# Altium schematic sheet 30C_battery_Charger.SchDoc
size 508 x 355 mm
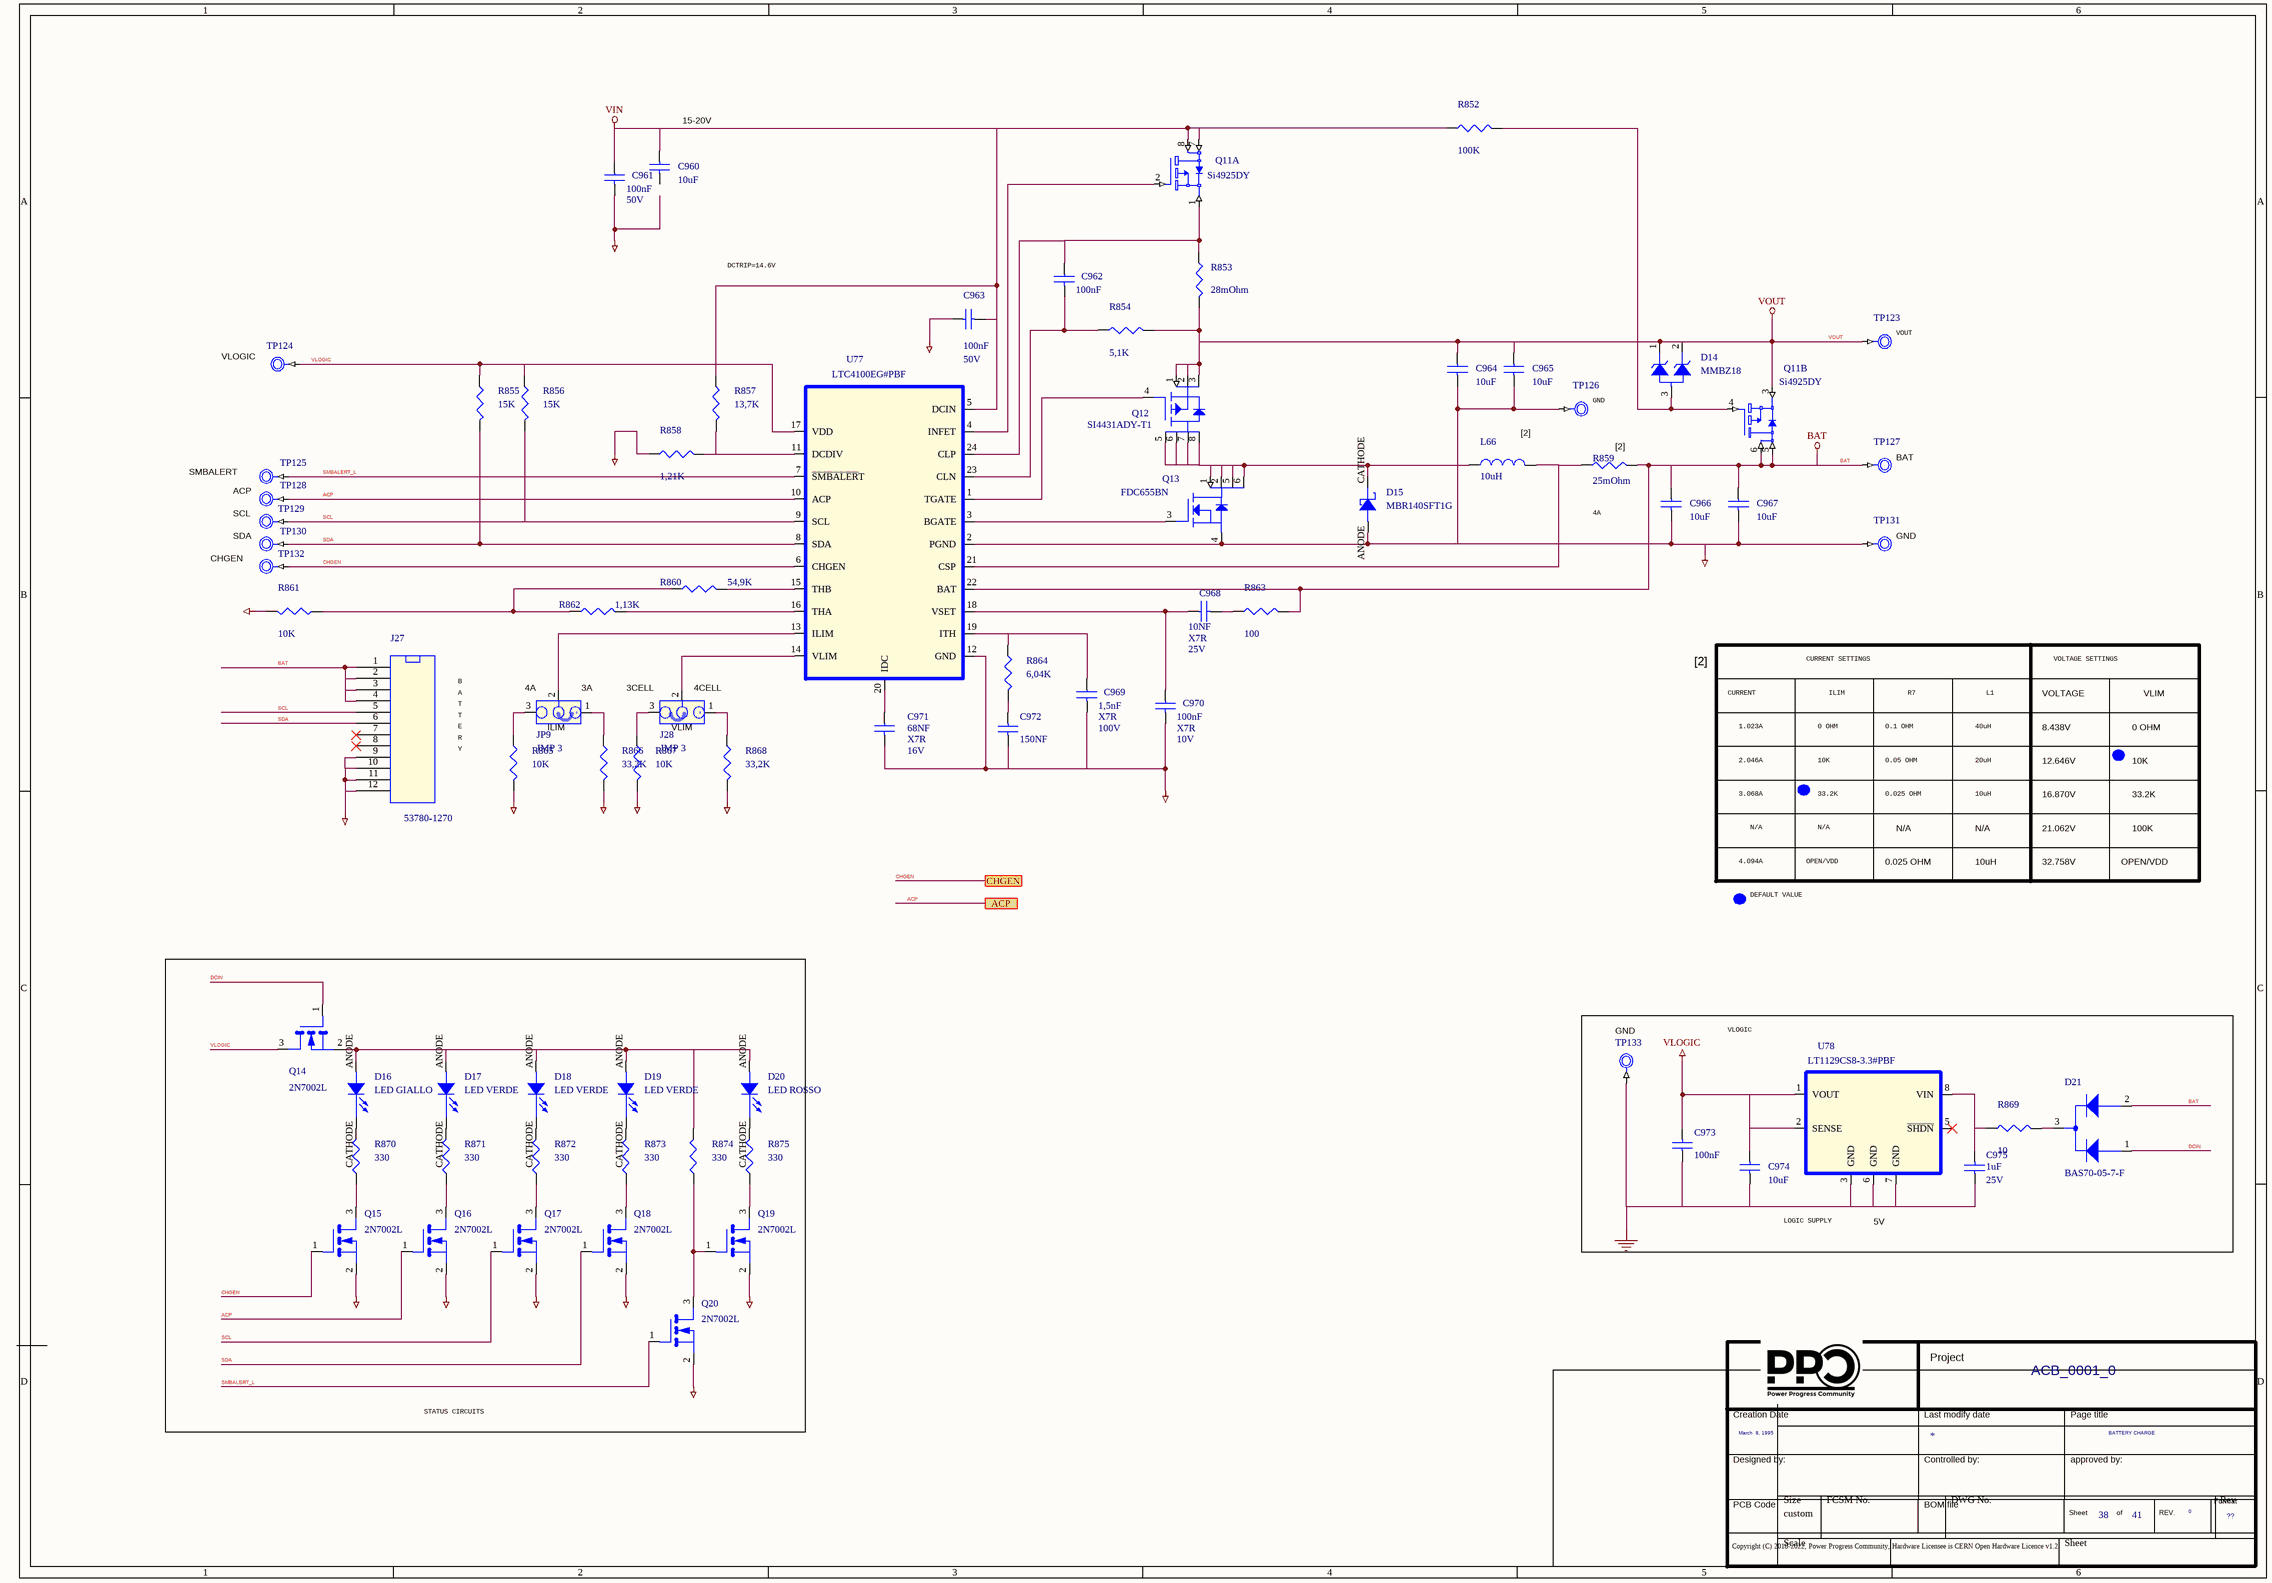
[diagram p0: 30C_battery_Charger.SchDoc]

## Parts
*  Page Count: 41  Page Create Date: March  8, 1995  Page Number: 38  Page Size: ??  Page Title: BATTERY CHARGE  RevCode: 0  Title: ACB_0001_0  (hidden comment: Title_block_PPC)  (graphical)
C960  10uF  [SMD_0603]
C961  100nF  Voltage: 50V  [SMD_0402]
C962  100nF  [SMD_0603]
C963  100nF  Voltage: 50V  [SMD_0402]
C964  10uF  [SMD_0603]
C965  10uF  [SMD_0603]
C966  10uF  [SMD_0603]
C967  10uF  [SMD_0603]
C968  10NF  Voltage: 25V  Tolerance: X7R  [SMD_0402]
C969  1,5nF  Tolerance: X7R  Voltage: 100V  [SMD_0402]
C970  100nF  Voltage: 10V  Tolerance: X7R  [SMD_0603]
C971  68NF  Voltage: 16V  Tolerance: X7R  [SMD_0402]
C972  150NF  [SMD_0402]
C973  100nF  [SMD_0603]
C974  10uF  [SMD_0603]
C975  1uF  Voltage: 25V  [SMD_0402]
D14  MMBZ18  [SOT_23]
D15  MBR140SFT1G  [sod123lf]
D16  LED GIALLO  [SMD_0603]
D17  LED VERDE  [SMD_0603]
D18  LED VERDE  [SMD_0603]
D19  LED VERDE  [SMD_0603]
D20  LED ROSSO  [SMD_0603]
D21  BAS70-05-7-F  [SOT-23]
J27  53780-1270  [SMD_2X50_P=0.635mm]
J28  JMP 3  [PTH]
JP9  JMP 3  [PTH]
L66  10uH  [SMD_10_2X10_5]
Q11  Si4925DY  [POWERPAK-SO-8/D]  (parts A,B of 2)
Q12  SI4431ADY-T1  [SOIC_8]
Q13  FDC655BN  [TSOT-23]
Q14  2N7002L  [SOT23]
Q15  2N7002L  [SOT23]
Q16  2N7002L  [SOT23]
Q17  2N7002L  [SOT23]
Q18  2N7002L  [SOT23]
Q19  2N7002L  [SOT23]
Q20  2N7002L  [SOT23]
R852  100K  [SMD_0402]
R853  28mOhm  [SMD_2512]
R854  5,1K  [SMD_0402]
R855  15K  [SMD_0402]
R856  15K  [SMD_0402]
R857  13,7K  [SMD_0402]
R858  1,21K  [SMD_0603]
R859  25mOhm  [SMD_2512]
R860  54,9K  [SMD_0603]
R861  10K  [SMD_0402]
R862  1,13K  [SMD_0402]
R863  100  [SMD_0402]
R864  6,04K  [SMD_0603]
R865  10K  [SMD_0603]
R866  33,2K  [SMD_0603]
R867  10K  [SMD_0402]
R868  33,2K  [SMD_0603]
R869  10  [SMD_0603]
R870  330  [SMD_0402]
R871  330  [SMD_0402]
R872  330  [SMD_0402]
R873  330  [SMD_0402]
R874  330  [SMD_0402]
R875  330  [SMD_0402]
TP123  Testpoint  [MILLMAX-2501-2]  (value not drawn)
TP124  Testpoint  [MILLMAX-2501-2]  (value not drawn)
TP125  Testpoint  [MILLMAX-2501-2]  (value not drawn)
TP126  Testpoint  [MILLMAX-2501-2]  (value not drawn)
TP127  Testpoint  [MILLMAX-2501-2]  (value not drawn)
TP128  Testpoint  [MILLMAX-2501-2]  (value not drawn)
TP129  Testpoint  [MILLMAX-2501-2]  (value not drawn)
TP130  Testpoint  [MILLMAX-2501-2]  (value not drawn)
TP131  Testpoint  [MILLMAX-2501-2]  (value not drawn)
TP132  Testpoint  [MILLMAX-2501-2]  (value not drawn)
TP133  mill-max-2308-2  [mill-max-2308]  (value not drawn)
U77  LTC4100EG#PBF  [SSOP-20GN]
U78  LT1129CS8-3.3#PBF  [SO-08]
XJP1  SHUNT  [NONE]  (value not drawn)
XJP2  SHUNT  [NONE]  (value not drawn)

## Blocks framed on the sheet
STATUS CIRCUITS: D16-D20 Q14-Q20 R870-R875

## Ports
ACP, CHGEN

## Nets
BAT: C966.1 C967.1 D21.2(C2) J27.1 J27.2 J27.3 J27.4 Q11.5(D) Q11.6(D) R859.2 R863.2 TP127.1 U77.22(BAT)
GND: C961.2 C963.1 C964.2 C965.2 C966.2 C967.2 C969.2 C970.2 C971.2 C972.2 C973.1 C974.2 C975.1 D15.ANODE J27.9 J27.10 J27.11 J27.12 Q13.4(SOURCE) Q15.2 Q16.2 Q17.2 Q18.2 Q19.2 Q20.2 R858.1 R861.2 R865.1 R866.2 R867.2 R868.2 TP126.1 TP131.1 TP133.1 U77.2(PGND) U77.12(GND) U78.3(GND) U78.6(GND) U78.7(GND)
VIN: C960.1 C961.1 C963.2 Q11.7(D) Q11.8(D) R852.1 R857.1 U77.5(DCIN)
VLOGIC: C973.2 C974.1 Q14.3 R855.1 R856.1 TP124.1 U77.17(VDD) U78.1(VOUT) U78.2(SENSE)
VOUT: C964.1 C965.1 D14.1(CATHODE1) D14.2(CATHODE2) Q11.3(S) Q12.1(S0) Q12.2(S1) Q12.3(S2) R853.2 R854.2 TP123.1
ACP: Q16.1 TP128.1 U77.10(ACP) ; port ACP
CHGEN: Q15.1 TP132.1 U77.6(CHGEN) ; port CHGEN
DCIN: D21.1(C1) Q14.1
SCL: J27.5 Q17.1 R856.2 TP129.1 U77.9(SCL)
SDA: J27.6 Q18.1 R855.2 TP130.1 U77.8(SDA)
SMBALERT_L: Q20.1 TP125.1 U77.7(~{SMBALER}T)
NetC962_1: C962.1 Q11.1(S) R853.1 U77.24(CLP)
NetC962_2: C962.2 R854.1 U77.23(CLN)
NetC968_1: C968.1 C970.1 U77.18(VSET)
NetC968_2: C968.2 R863.1
NetC969_1: C969.1 R864.1 U77.19(ITH)
NetC971_1: C971.1 U77.20(IDC)
NetC972_1: C972.1 R864.2
NetC975_2: C975.2 R869.1 U78.8(VIN)
NetD14_3: D14.3(ANODE) Q11.4(G) R852.2
NetD15_CATHODE: D15.CATHODE L66.1 Q12.5(D0) Q12.6(D1) Q12.7(D2) Q12.8(D4) Q13.1(DRAIN1) Q13.2(DRAIN2) Q13.5(DRAIN3) Q13.6(DRAIN4)
NetD16_ANODE: D16.ANODE D17.ANODE D18.ANODE D19.ANODE D20.ANODE Q14.2 R874.2
NetD16_CATHODE: D16.CATHODE R870.2
NetD17_CATHODE: D17.CATHODE R871.2
NetD18_CATHODE: D18.CATHODE R872.2
NetD19_CATHODE: D19.CATHODE R873.2
NetD20_CATHODE: D20.CATHODE R875.2
NetD21_3: D21.3(A) R869.2
NetJ28_1: J28.1 R868.1
NetJ28_2: J28.2 U77.14(VLIM)
NetJ28_3: J28.3 R867.1
NetJP9_1: JP9.1 R866.1
NetJP9_2: JP9.2 U77.13(ILIM)
NetJP9_3: JP9.3 R865.2
NetL66_2: L66.2 R859.1 U77.21(CSP)
NetQ11_2: Q11.2(G) U77.4(INFET)
NetQ12_4: Q12.4(G) U77.1(TGATE)
NetQ13_3: Q13.3(GATE) U77.3(BGATE)
NetQ15_3: Q15.3 R870.1
NetQ16_3: Q16.3 R871.1
NetQ17_3: Q17.3 R872.1
NetQ18_3: Q18.3 R873.1
NetQ19_1: Q19.1 Q20.3 R874.1
NetQ19_3: Q19.3 R875.1
NetR857_2: R857.2 R858.2 U77.11(DCDIV)
NetR860_1: R860.1 R861.1 R862.1
NetR860_2: R860.2 U77.15(THB)
NetR862_2: R862.2 U77.16(THA)

Not connected (* = marked no-connect by the designer): C960 2; J27 7* 8*; U78 5(~{SHDN})*

## Notes on the sheet
- (near C960) 15-20V
- DCTRIP=14.6V
- (near TP124) VLOGIC
- (near TP123) VOUT
- (near TP126) GND
- SMBALERT
- [2]
- (near R859) [2]
- (near TP127) BAT
- ACP
- SCL
- 4A
- CHGEN
- SDA
- (near TP131) GND
- B
- A
- (near JP9) 4A
- (near JP9) 3A
- (near J28) 3CELL
- (near J28) 4CELL
- CURRENT
- CURRENT SETTINGS
- ILIM
- R7
- L1
- VOLTAGE
- VOLTAGE SETTINGS
- VLIM
- T
- E
- R
- Y
- (near XJP2) VLIM
- 1.023A
- 0 OHM
- 0.1 OHM
- 40uH
- 8.438V
- 2.046A
- 3.068A
- 10K
- 33.2K
- 0.05 OHM
- 0.025 OHM
- 20uH
- 10uH
- 12.646V
- 16.870V
- 4.094A
- N/A
- OPEN/VDD
- 21.062V
- 32.758V
- 100K
- DEFAULT VALUE
- (near TP133) GND
- VLOGIC
- LOGIC SUPPLY
- 5V
- (in symbol Title_block_PPC) Project; Creation Date; Last modify date; Page title; Designed by:; Controlled by:; approved by:; Format; PCB Code; BOM file; Sheet; of; REV.; Copyright (C) 2018-2022, Power Progress Community, Hardware Licensee is CERN Open Hardware Licence v1.2

## Library data of the parts
C960 C964-C967 C974 = CAP NP_Dup3: COND.CER.10uF 0603 25V SMD; Part Number: PASSIVE_124; Manufacturer 1: SAMSUNG; Manufacturer Part Number 1: CL10A106MA8NRNC; RSM: RC0603; Part Type: Capacitors\Ceramic\SMD\0603; PCB Footprint: SMD_0603
C961 C963 = CAP NP_Dup9: COND.CER. 100NF 50V 0402 X7R SMD; Part Number: PASSIVE_24; Manufacturer 1: TDK; Manufacturer Part Number 1: CGA2B3X7R1H104M050BD; RSM: RC0402; Field1: 0805; Part Type: Capacitors\Ceramic\SMD\0402; Tolerance: X7R; PCB Footprint: SMD_0402
C962 C970 C973 = CAP NP_Dup9: COND.CER.100NF 25V 0603 X7R SMD; Manufacturer Part Number 1: PHY223891615649; Manufacturer 1: PHILIPS; Part Number: PASSIVE_117; RSM: RC0603; Field1: 0603; PCB Footprint: SMD_0603; Part Type: Capacitors\Ceramic\SMD\0603
  C962: Tolerance: X7R; Voltage: 25V
  C973: Voltage: 25V; Tolerance: X7R
C968 = CAP NP_Dup9: COND.CER. 10NF 50V 0402 X7R SMD; Part Number: PASSIVE_29; Manufacturer 1: KEMET; Manufacturer Part Number 1: C0402C103K5RACTU; Field1: 0603; RSM: RC0402; Part Type: Capacitors\Ceramic\SMD\0402; PCB Footprint: SMD_0402
C969 = CAP NP_Dup9: COND.CER. 1,5nF 50V 0402 X7R SMD; Manufacturer Part Number 1: 04022R152J9B20D; Manufacturer 1: YAGEO; Part Number: PASSIVE_16; RSM: RC0402; Field1: 0603; PCB Footprint: SMD_0402; Part Type: Capacitors\Ceramic\SMD\0402
C971 = CAP NP_Dup9: COND.CER. 68NF 50V 0402 X7R SMD; Manufacturer Part Number 1: GRM155R61C683KA01J; Manufacturer 1: Murata; Part Number: PASSIVE_101; RSM: RC0402; Field1: 0603; PCB Footprint: SMD_0402; Part Type: Capacitors\Ceramic\SMD\0402
C972 = CAP NP_Dup3: CAP CER 0.15UF 16V 10% X7R 0402; Manufacturer Part Number 1: C1005X7R1C154K050BC; Manufacturer 1: TDK; Part Number: PASSIVE_38; RSM: RC0402; PCB Footprint: SMD_0402; Part Type: Capacitors\Ceramic\SMD\0402
C975 = CAP NP_Dup9: CAP CER 1UF 25V X6S 0402; Part Number: PASSIVE_1446; Manufacturer 1: Murata; Manufacturer Part Number 1: GRM155C81E105KE11D; Field1: 0603; Tolerance: X7R; RSM: RC0402; Part Type: Capacitors\Ceramic\SMD\0402; PCB Footprint: SMD_0402
D14 = DIODO_ZENER_SOT23_DOPPIO: DIODO, TVS ZENER DUAL, 18V, 40W, SOT23; Part Number: DISCRETE_131; Manufacturer 1: Motorola; Manufacturer Part Number 1: MMBZ18VALT1G; RSM: SOT-23; PCB Footprint: SOT_23; Part Type: Diodes\ZENER; Distributor 1: DIGIKEY(MMBZ18VALT1GOSCT-ND)
D15 = diode_schottky_A1C2_0: DIODE SCH PWR RECT 1A 40V SOD123; Manufacturer 1: ON SEMICONDUCTOR; Part Number: DISCRETE_95; RSM: SOD123-F-AK-NXP; PCB Footprint: sod123lf; Distributor 1: DIGIKEY(MBR140SFT1GOSTR-ND); Manufacturer Part Number 1: MBR140SFT1G; Part Type: Diodes\SCHOTTKY
D16 = LED_0: LED CHIPLED GIALLO 160Deg 6.5mcd; Manufacturer Part Number 1: TLMY1000-GS08; Manufacturer 1: Vishay; Part Number: DISCRETE_24; RSM: LED0603-AK; PCB Footprint: SMD_0603; Distributor 1: MOUSER(78-TLMY1000); Part Type: Diodes\LED
D17-D19 = LED_0: LED CHIPLED VERDE 40mcd 570nm; Manufacturer Part Number 1: 598-8070-107F; Manufacturer 1: DIALIGHT; Part Number: DISCRETE_31; RSM: LED0603-AK; PCB Footprint: SMD_0603; Distributor 1: MOUSER(645-598-8070-107F); Part Type: Diodes\LED
D20 = LED_0: LED CHIPLED ROSSO; Manufacturer Part Number 1: APT1608SRCPRV; Manufacturer 1: KINGBRIGHT; Part Number: DISCRETE_30; RSM: LED0603-AK; PCB Footprint: SMD_0603; Distributor 1: MOUSER(604-APT1608SRCPRV); Part Type: Diodes\LED
D21 = BAT54C: DIODE SCHOTTKY 70V 70MA SOT23; Manufacturer 1: DIODES; Part Number: DISCRETE_82; Distributor 1: DIGIKEY(BAS70-05FDICT-ND); Manufacturer Part Number 1: BAS70-05-7-F; Part Type: Diodes\SCHOTTKY; PCB Footprint: SOT-23; RSM: SOT-23
J27 = HEADER_12X1: Terminali e capicorda 1.25 WtB ssy 12Ckt; PART NUMBER: CONNECTORS_686; Manufacturer 1: MOLEX; PCB Footprint: 1X12 1.25mm smd; RSM: MOLEX-53780-12; Part Type: B2W; Manufacturer Part Number 1: 53780-1270; Distributor 1: MOUSER(538-53780-1270)
J28 JP9 = JUMPER_3: STRIP MASC.1x3P CS.p=2.54mm; Part Number: CONNECTORS_449; Manufacturer 1: Samtec; Manufacturer Part Number 1: TLW-103-05-G-S; RSM: PIN-100MLS-3; PCB Footprint: PTH; Part Type: Strip\Terminal; Distributor 1: FARNELL(1668490)
L66 = INDUCTOR_Dup1: Induttori fissi WE-HCI Flat 1050 10uH 7.2A; Manufacturer Part Number 1: 7443251000; Manufacturer 1: WURTH; Part Number: PASSIVE_1470; RSM: IND-WE-7443251000; Part Type: Inductors\SMD; PCB Footprint: SMD_10_2X10_5
Q11 = SI7941DP: Trans MOSFET P-CH 30V 5.3A 8-Pin SOIC; 7th Part Field: Dual P-Chan.,; 4th Part Field: Siliconix; Part Number: DISCRETE_320; Manufacturer 1: ON SEMICONDUCTOR; Manufacturer Part Number 1: SI4431ADY-T1; PCB Footprint: SOIC_8; RSM: SO-8; Part Type: Mosfet\HIGH_SIDE; Distributor 1: ARROW (SI4431ADY-T1)
Q12 = Si4431ADY: Trans MOSFET P-CH 30V 5.3A 8-Pin SOIC; Part Number: DISCRETE_319; Manufacturer 1: Vishay; RSM: SO-8; Part Type: Mosfet\HIGH_SIDE; PCB Footprint: SOIC_8; Manufacturer Part Number 1: SI4431ADY-T1; Distributor 1: ARROEW (FDC645N)
Q13 = FDC645N: MOSFET N-CH 30V 6.3A 6-Pin TSOT-23; Part Number: DISCRETE_318; Manufacturer 1: ON Semi; RSM: TSOT-6; Part Type: Mosfet\HIGH_SIDE; PCB Footprint: TSOT-23; Manufacturer Part Number 1: FDC655BN; Distributor 1: ARROW (FDC655BN)
Q14-Q20 = 2N7002: TRAN NMOS 60V 115MA SOT23; Part Number: DISCRETE_188; Manufacturer 1: ON SEMICONDUCTORS; Manufacturer Part Number 1: 2N7002LT1G; RSM: SOT-23; PCB Footprint: sot23; Part Type: Mosfet\SOT23; Distributor 1: DIGIKEY(2N7002LT3GOSCT-ND)
R852 = R_Dup6: RESIS.CHIP 100K 5% 0402 SMD; Part Number: PASSIVE_813; Manufacturer 1: ROYAL OHM; RSM: RC0402; Part Type: Resistors\Fixed\SMD\0402\5%; PCB Footprint: SMD_0402; Manufacturer Part Number 1: RESIS.CHIP 100K 5% 0402 SMD
R853 = R_Dup6: Current Sense Resistors - SMD 0.028 Ohm 1% 1W; Manufacturer Part Number 1: WSL2512R0280FEA18; Manufacturer 1: Vishay; Part Number: PASSIVE_1465; RSM: RC2512; PCB Footprint: SMD_2512; Part Type: Resistors\Fixed\SMD\Current Sense
R854 = R_Dup6: RES SMD 5.1K OHM 1% 1/16W 0402; Manufacturer Part Number 1: RC0402FR-075K1L; Manufacturer 1: YAGEO; Part Number: PASSIVE_742; RSM: RC0402; PCB Footprint: SMD_0402; Part Type: Resistors\Fixed\SMD\0402\1%
R855 R856 = R_Dup6: RESIS.CHIP 15K 1% 0402 SMD; Part Number: PASSIVE_614; Manufacturer 1: ROYAL OHM; RSM: RC0402; Part Type: Resistors\Fixed\SMD\0402\1%; PCB Footprint: SMD_0402; Manufacturer Part Number 1: RESIS.CHIP 15K 1% 0402 SMD
R857 = R_Dup6: RESIS.CHIP 13,7K 1% 0402 SMD; Part Number: PASSIVE_600; Manufacturer 1: PANASONIC; Manufacturer Part Number 1: ERJ-2RKF1372X; RSM: RC0402; Part Type: Resistors\Fixed\SMD\0402\1%; PCB Footprint: SMD_0402
R858 = R_Dup6: RESIS.CHIP 1,21K 1% 0603 SMD; Manufacturer Part Number 1: RES.1K21 1% 0603 SMD; Manufacturer 1: ROYAL OHM; Part Number: PASSIVE_884; RSM: RC0603; PCB Footprint: SMD_0603; Part Type: Resistors\Fixed\SMD\0603\1%
R859 = R_Dup6: Current Sense Resistors - SMD 0.025 Ohm 1% 1W; Part Number: PASSIVE_1466; Manufacturer 1: Vishay; Manufacturer Part Number 1: WSL2512R0250FEA18; RSM: RC2512; PCB Footprint: SMD_2512; Part Type: Resistors\Fixed\SMD\Current Sense
R860 = R_Dup6: RESIS.CHIP 54,9K 1% 0603 SMD E96; Part Number: PASSIVE_1041; Manufacturer 1: ROYAL OHM; Manufacturer Part Number 1: CHIP RES.54K9 0603 1%; RSM: RC0603; PCB Footprint: SMD_0603; Part Type: Resistors\Fixed\SMD\0603\1%
R861 R867 = R_Dup6: RESIS.CHIP 10K 1% 0402 SMD; Part Number: PASSIVE_584; Manufacturer 1: ROYAL OHM; RSM: RC0402; Part Type: Resistors\Fixed\SMD\0402\1%; PCB Footprint: SMD_0402; Manufacturer Part Number 1: RESIS.CHIP 10K 1% 0402 SMD
R862 = R_Dup6: RESIS.CHIP 1,13K 1% 0402 SMD; Manufacturer Part Number 1: RC0402FR-071K13L; Manufacturer 1: YAGEO; Part Number: PASSIVE_569; RSM: RC0402; PCB Footprint: SMD_0402; Part Type: Resistors\Fixed\SMD\0402\1%
R863 = R_Dup6: RESIS.CHIP 100R 5% 0402 SMD; Part Number: PASSIVE_812; Manufacturer 1: ROYAL OHM; RSM: RC0402; Part Type: Resistors\Fixed\SMD\0402\5%; PCB Footprint: SMD_0402; Manufacturer Part Number 1: RESIS.CHIP 100R 5% 0402 SMD
R864 = R_Dup6: RESIS.CHIP 6K04 1% 0603 SMD; Manufacturer 1: ROYAL OHM; Part Number: PASSIVE_1047; RSM: RC0603; Manufacturer Part Number 1: RESIS.CHIP 6K04 1% 0603 SMD; PCB Footprint: SMD_0603; Part Type: Resistors\Fixed\SMD\0603\1%
R865 = R_Dup6: RESIS.CHIP 10K 1% 0603 SMD; Manufacturer Part Number 1: RES.10K 0603 1% SMD; Manufacturer 1: ROYAL OHM; Part Number: PASSIVE_900; RSM: RC0603; PCB Footprint: SMD_0603; Part Type: Resistors\Fixed\SMD\0603\1%
R866 R868 = R_Dup6: RESIS.CHIP 33K2 1% 0603 SMD; Part Number: PASSIVE_988; Manufacturer 1: ROYAL OHM; RSM: RC0603; Part Type: Resistors\Fixed\SMD\0603\1%; PCB Footprint: SMD_0603; Manufacturer Part Number 1: RESIS.CHIP 33K2 1% 0603 SMD
R869 = R_Dup6: RESIS.CHIP 10R 1% 0603 SMD; Manufacturer 1: ROYAL OHM; Part Number: PASSIVE_896; RSM: RC0603; Manufacturer Part Number 1: RESIS.CHIP 10R 1% 0603 SMD; PCB Footprint: SMD_0603; Part Type: Resistors\Fixed\SMD\0603\1%
R870-R875 = R_Dup6: RESIS.CHIP 330R 5% 0402 SMD; Manufacturer 1: ROYAL OHM; Part Number: PASSIVE_854; RSM: RC0402; Manufacturer Part Number 1: RESIS.CHIP 330R 5% 0402 SMD; PCB Footprint: SMD_0402; Part Type: Resistors\Fixed\SMD\0402\5%
TP123-TP132 = MillMax-2501-2: TURRET; 5th Part Field: 2501-2; 7th Part Field: Turret,; Part Number: MILL-MAX 2308-2; PCB Footprint: MM/2308; RSM: AE-TESTPOINT; 4th Part Field: Mill Max
TP133 = mill-max-2308-2: TURRET; 5th Part Field: 2308-2; 7th Part Field: Testpoint,; Part Number: MILL-MAX 2308-2; PCB Footprint: MM/2308; RSM: AE-TESTPOINT; 4th Part Field: Mill-Max
U77 = LTC4008EGN_3: IC SMART BATTERY CHARGER 24-SSOP; Part Number: LINEAR_335; Manufacturer 1: ANALOG; Manufacturer Part Number 1: LTC4100EG#PBF / LTC4100EG#PBF; RSM: SSOP-24; Part Type: Regulators\battcharge; PCB Footprint: 24-SSOP; Distributor 1: DIGIKEY(LTC4100EG#PBF-ND)
U78 = LT1129CS8_0: IC REG LINEAR 3.3V 700MA 8SOIC; Manufacturer 1: ANALOG; Part Number: LINEAR_336; 7TH_PART_FIELD: I.C.; RSM: SO-8; PCB Footprint: SOIC8; 2ND PART FIELD: SO-08; Distributor 1: DIGIKEY(LT1129CS8-3.3#PBF-ND); Manufacturer Part Number 1: LT1129CS8-3.3#PBF; Part Type: Regulators\LDO; 4TH_PART_FIELD: LINEAR; 5TH_PART_FIELD: LT1129CS8-3.3
XJP1 XJP2 = SHUNT_0: Part Number: SAMTEC 2SN-BK-G; PCB Footprint: none
* = Title_block_PPC: Page Modify Date: *